# EAGLE schematic POCN_Vrevised_labeled_copied (EAGLE 9.6.2)
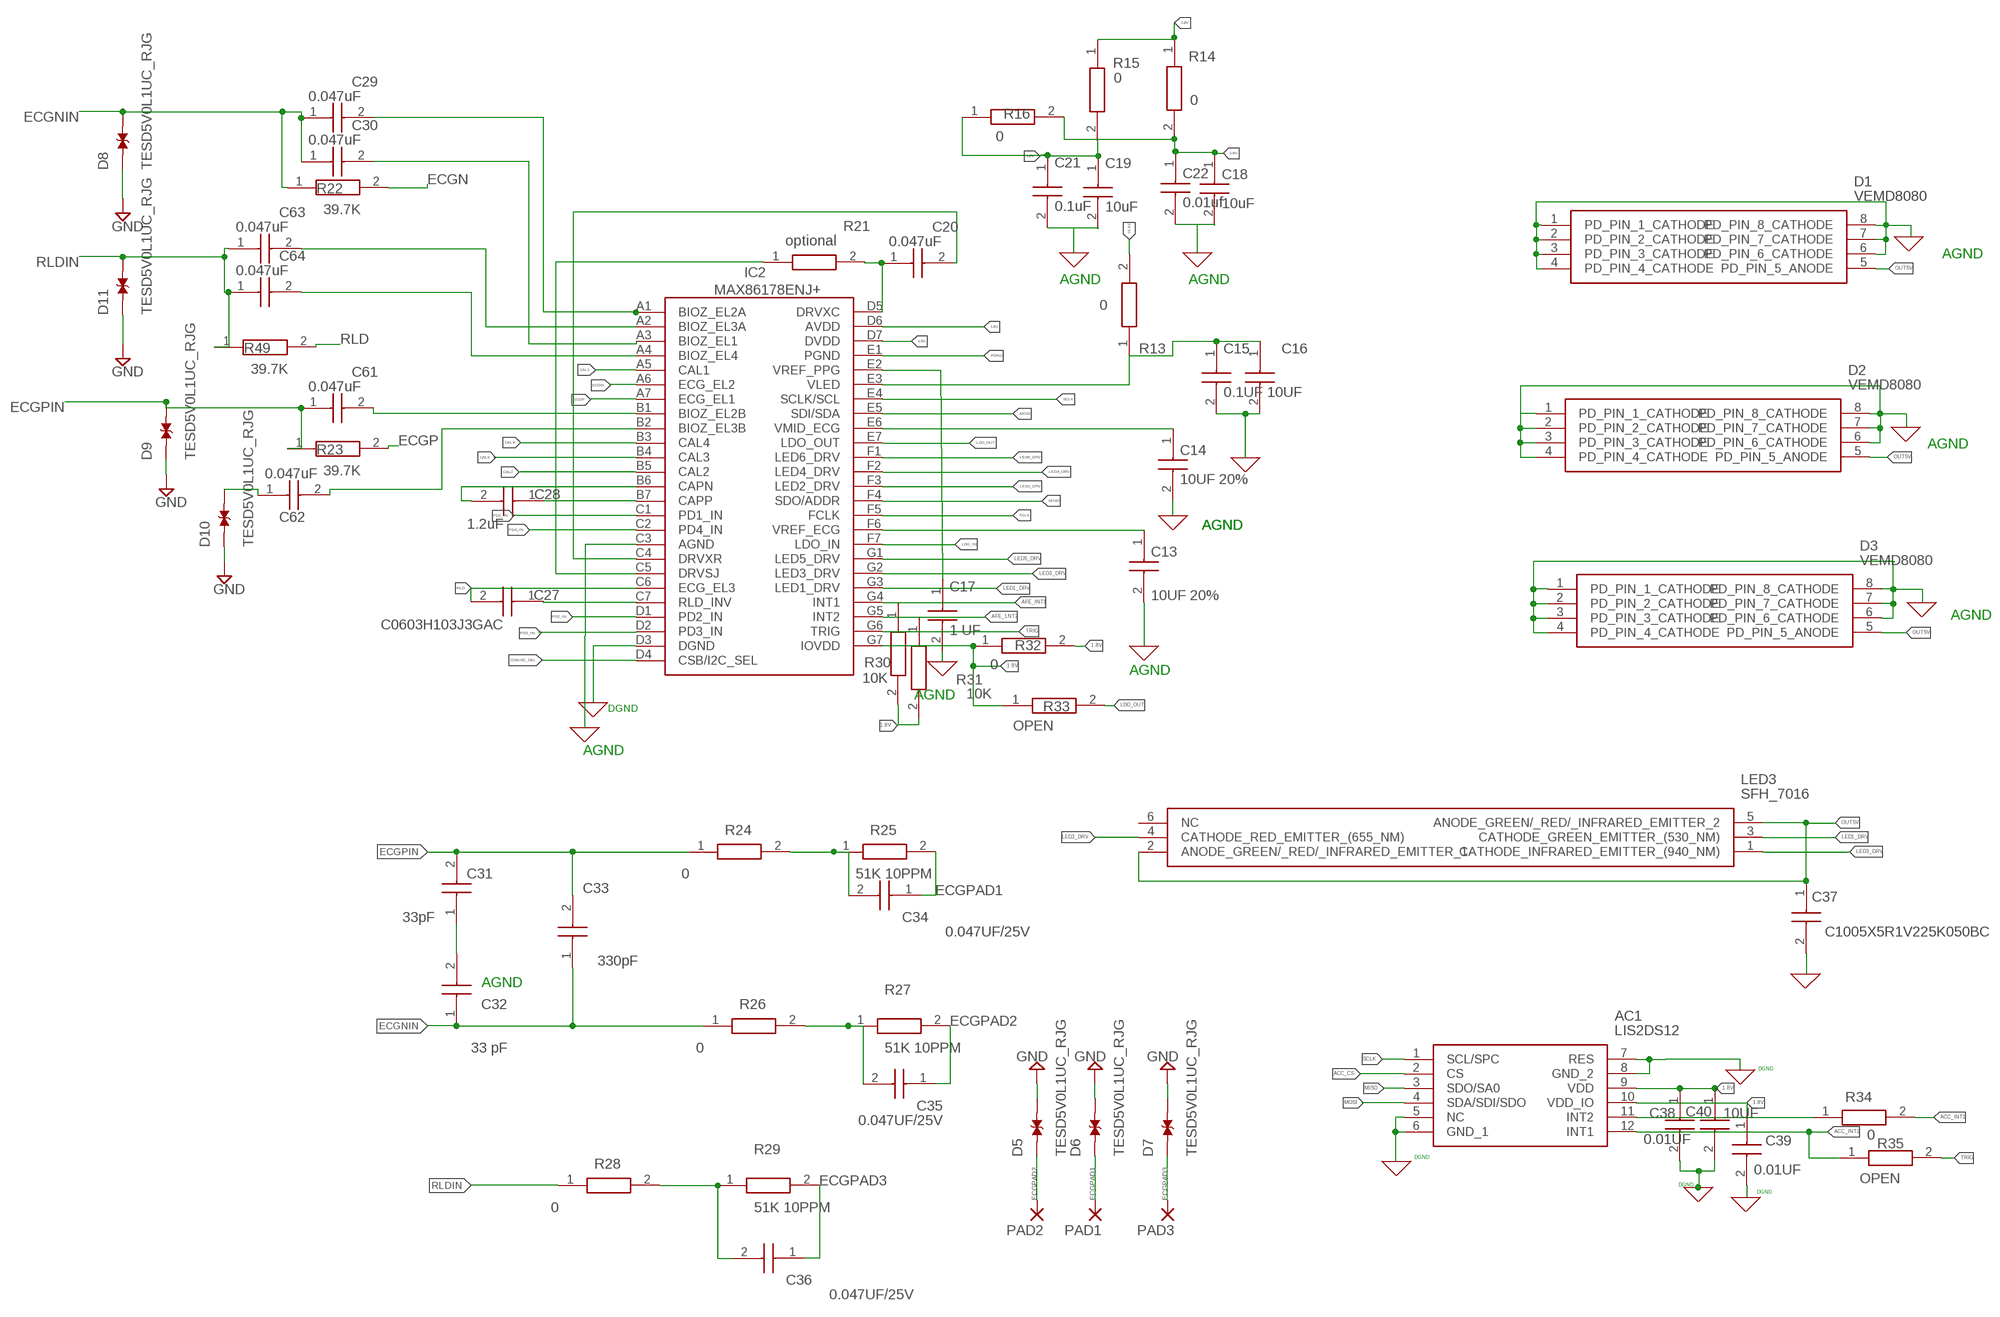
[diagram p0: schematic, sheet 1]

## Parts
AC1  LIS2DS12  [LGA-12]
C13  10UF 20%  GRM188R60J226ME15D  [CAPC1608X90N]
C14  10UF 20%  GRM188R60J226ME15D  [CAPC1608X90N]
C15  0.1UF  GRM188R60J226ME15D  [CAPC1608X90N]
C16  10UF  C1005X5R1V225K050BC  [C1005_COMMERCIAL]
C17  1 UF  C0603H103J3GAC  [C0603]
C18  10uF  C0603H103J3GAC  [C0603]
C19  10uF  C0603H103J3GAC  [C0603]
C20  0.047uF  C1005X5R1V225K050BC  [C1005_COMMERCIAL]
C21  0.1uF  C1005X5R1V225K050BC  [C1005_COMMERCIAL]
C22  0.01uf  C1005X5R1V225K050BC  [C1005_COMMERCIAL]
C27  C0603H103J3GAC  [C0603]
C28  1.2uF  C0603H103J3GAC  [C0603]
C29  0.047uF  C1005X5R1V225K050BC  [C1005_COMMERCIAL]
C30  0.047uF  C1005X5R1V225K050BC  [C1005_COMMERCIAL]
C31  33pF  C0603H103J3GAC  [C0603]
C32  33 pF  C0603H103J3GAC  [C0603]
C33  330pF  C0603H103J3GAC  [C0603]
C34  0.047UF/25V  C0603H103J3GAC  [C0603]
C35  0.047UF/25V  C0603H103J3GAC  [C0603]
C36  0.047UF/25V  C0603H103J3GAC  [C0603]
C37  C1005X5R1V225K050BC  [C1005_COMMERCIAL]
C38  0.01UF  C1005X5R1V225K050BC  [C1005_COMMERCIAL]
C39  0.01UF  C1005X5R1V225K050BC  [C1005_COMMERCIAL]
C40  10UF  C0805C125K4RACTU  [CAPC2012X88N]
C61  0.047uF  C1005X5R1V225K050BC  [C1005_COMMERCIAL]
C62  0.047uF  C1005X5R1V225K050BC  [C1005_COMMERCIAL]
C63  0.047uF  C1005X5R1V225K050BC  [C1005_COMMERCIAL]
C64  0.047uF  C1005X5R1V225K050BC  [C1005_COMMERCIAL]
D1  VEMD8080  [VEMD8080]
D2  VEMD8080  [VEMD8080]
D3  VEMD8080  [VEMD8080]
D5  TESD5V0L1UC_RJG  [DIO_TESD5V0L1UC_RJG]
D6  TESD5V0L1UC_RJG  [DIO_TESD5V0L1UC_RJG]
D7  TESD5V0L1UC_RJG  [DIO_TESD5V0L1UC_RJG]
D8  TESD5V0L1UC_RJG  [DIO_TESD5V0L1UC_RJG]
D9  TESD5V0L1UC_RJG  [DIO_TESD5V0L1UC_RJG]
D10  TESD5V0L1UC_RJG  [DIO_TESD5V0L1UC_RJG]
D11  TESD5V0L1UC_RJG  [DIO_TESD5V0L1UC_RJG]
IC2  MAX86178ENJ+  [BGA49C35P7X7_277X257X50]
LED3  SFH_7016  [SFH7016]
PAD1  SMD5  [SMD2,54-5,08]
PAD2  SMD5  [SMD2,54-5,08]
PAD3  SMD5  [SMD2,54-5,08]
R13  0  CRCW0402499RFKED  [RESC1005X40N]
R14  0  CRCW0402499RFKED  [RESC1005X40N]
R15  0  CRCW0402499RFKED  [RESC1005X40N]
R16  0  CRCW0402499RFKED  [RESC1005X40N]
R21  optional  CRCW0402499RFKED  [RESC1005X40N]
R22  39.7K  CRCW0402499RFKED  [RESC1005X40N]
R23  39.7K  CRCW0402499RFKED  [RESC1005X40N]
R24  0  CRCW060310K0FKEI  [RESC1608X50N]
R25  51K 10PPM  CRCW060310K0FKEI  [RESC1608X50N]
R26  0  CRCW060310K0FKEI  [RESC1608X50N]
R27  51K 10PPM  CRCW060310K0FKEI  [RESC1608X50N]
R28  0  CRCW060310K0FKEI  [RESC1608X50N]
R29  51K 10PPM  CRCW060310K0FKEI  [RESC1608X50N]
R30  10K  CRCW060310K0FKEI  [RESC1608X50N]
R31  10K  CRCW060310K0FKEI  [RESC1608X50N]
R32  0  CRCW060310K0FKEI  [RESC1608X50N]
R33  OPEN  CRCW060310K0FKEI  [RESC1608X50N]
R34  0  CRCW0402499RFKED  [RESC1005X40N]
R35  OPEN  CRCW0402499RFKED  [RESC1005X40N]
R49  39.7K  CRCW0402499RFKED  [RESC1005X40N]

## Nets
1.8V: AC1.9(VDD) AC1.10(VDD_IO) C18.1 C19.1 C21.1 C22.1 C38.1 C39.1 C40.1 IC2.D6(AVDD) IC2.D7(DVDD) R14.1 R14.2 R15.1 R15.2 R16.1 R16.2 R30.2 R31.2 R32.2
ACC_CS: AC1.2(CS)
ACC_INT1: R34.2
ACC_INT2: AC1.12(INT1) R35.1
AFE_1NT2: IC2.G5(INT2)
AFE_INT1: IC2.G4(INT1)
AGND: AC1.7(RES) AC1.8(GND_2) C13.2 C14.2 C15.2 C16.2 C17.2 ; supply symbol labelled GND
CAL1: IC2.A5(CAL1)
CAL2: IC2.B5(CAL2)
CAL3: IC2.B4(CAL3)
CAL4: IC2.B3(CAL4)
CSB/I2C_SEL: IC2.D4(CSB/I2C_SEL)
ECGN: IC2.A6(ECG_EL2) R22.2
ECGNIN: C29.1 C30.1 C32.1 C33.1 D8.2 R22.1 R26.1
ECGP: IC2.A7(ECG_EL1) R23.2
ECGPAD1: C34.1 D6.1 PAD1.1(P) R25.2
ECGPAD2: C35.1 D5.1 PAD2.1(P) R27.2
ECGPAD3: C36.1 D7.1 PAD3.1(P) R29.2
ECGPIN: C31.2 C33.2 C61.1 D9.2 R23.1 R24.1
FCLK: IC2.F5(FCLK)
GND: D5.2 D6.2 D7.2 D8.1 D9.1 D10.1 D11.1
LDO_IN: IC2.F7(LDO_IN)
LDO_OUT: IC2.E7(LDO_OUT) R33.2
LED1_DRV: IC2.G3(LED1_DRV) LED3.3(CATHODE_GREEN_EMITTER_(530_NM))
LED2_DRV: IC2.F3(LED2_DRV)
LED3_DRV: IC2.G2(LED3_DRV) LED3.1(CATHODE_INFRARED_EMITTER_(940_NM)) LED3.4(CATHODE_RED_EMITTER_(655_NM))
LED4_DRV: IC2.F2(LED4_DRV)
LED5_DRV: IC2.G1(LED5_DRV)
LED6_DRV: IC2.F1(LED6_DRV)
MISO: AC1.3(SDO/SA0) IC2.F4(SDO/ADDR)
MOSI: AC1.4(SDA/SDI/SDO) IC2.E5(SDI/SDA)
N$3: C37.2
N$5: D1.1(PD_PIN_1_CATHODE) D1.2(PD_PIN_2_CATHODE) D1.3(PD_PIN_3_CATHODE) D1.4(PD_PIN_4_CATHODE) D1.6(PD_PIN_6_CATHODE) D1.7(PD_PIN_7_CATHODE) D1.8(PD_PIN_8_CATHODE)
N$7: AC1.5(NC) AC1.6(GND_1)
N$26: C13.1 IC2.F6(VREF_ECG)
N$30: C14.1 IC2.E6(VMID_ECG)
N$31: IC2.E3(VLED)
N$32: C17.1 IC2.E2(VREF_PPG)
N$33: C15.1 C16.1 R13.1
N$46: C20.1 IC2.D5(DRVXC) R21.2
N$47: C19.2 C21.2
N$48: C18.2 C22.2
N$49: C20.2 IC2.C4(DRVXR)
N$50: IC2.C5(DRVSJ) R21.1
N$51: C27.1 IC2.C7(RLD_INV)
N$52: IC2.D3(DGND)
N$53: IC2.C3(AGND)
N$55: IC2.B7(CAPP)
N$56: C28.2 IC2.B6(CAPN)
N$57: C30.2 IC2.A3(BIOZ_EL1)
N$60: C61.2 IC2.B1(BIOZ_EL2B)
N$61: C62.1 D10.2
N$62: C62.2 IC2.B2(BIOZ_EL3B)
N$64: C63.2 IC2.A2(BIOZ_EL3A)
N$65: C64.2 IC2.A4(BIOZ_EL4)
N$67: C29.2 IC2.A1(BIOZ_EL2A)
N$68: D3.1(PD_PIN_1_CATHODE) D3.2(PD_PIN_2_CATHODE) D3.3(PD_PIN_3_CATHODE) D3.4(PD_PIN_4_CATHODE) D3.6(PD_PIN_6_CATHODE) D3.7(PD_PIN_7_CATHODE) D3.8(PD_PIN_8_CATHODE)
N$69: C35.2 R26.2 R27.1
N$70: C31.1 C32.2
N$71: D2.1(PD_PIN_1_CATHODE) D2.2(PD_PIN_2_CATHODE) D2.3(PD_PIN_3_CATHODE) D2.4(PD_PIN_4_CATHODE) D2.6(PD_PIN_6_CATHODE) D2.7(PD_PIN_7_CATHODE) D2.8(PD_PIN_8_CATHODE)
N$72: C34.2 R24.2 R25.1
N$76: C36.2 R28.2 R29.1
N$78: IC2.G7(IOVDD) R32.1 R33.1
N$82: AC1.11(INT2) R34.1
N$84: C38.2 C40.2
N$86: C39.2
OUT5V: C37.1 D1.5(PD_PIN_5_ANODE) D2.5(PD_PIN_5_ANODE) D3.5(PD_PIN_5_ANODE) LED3.2(ANODE_GREEN/_RED/_INFRARED_EMITTER_1) LED3.5(ANODE_GREEN/_RED/_INFRARED_EMITTER_2)
PD1_IN: IC2.C1(PD1_IN)
PD2_IN: IC2.D1(PD2_IN)
PD3_IN: IC2.D2(PD3_IN)
PD4_IN: IC2.C2(PD4_IN)
PGND: IC2.E1(PGND)
RLD: C27.2 IC2.C6(ECG_EL3) R49.2
RLDIN: C63.1 C64.1 D11.2 R28.1 R49.1
SCLK: AC1.1(SCL/SPC) IC2.E4(SCLK/SCL)
TRIG: IC2.G6(TRIG) R35.2
VLED: R13.2
Unconnected: C28.1 LED3.6(NC) R30.1 R31.1

## Notes on the sheet
- AGND
- AGND | AGND
- AGND
- AGND | AGND
- AGND
- AGND
- AGND
- DGND
- AGND
- AGND
- DGND
- DGND
- DGND
- DGND

## Library data of the parts
AC1 = LIS2DS12:LIS2DS12: STMicroelectronics LIS2DS12 3-Axis Accelerometer Ic, 1.62 1.98 V 12-Pin LGA Source: Datasheet <http://www.st.com/content/ccc/resource/technical/document/datasheet/ce/32/55/ac/e1/87/46/84/DM00177048.pdf/files/DM00177048.pdf/jcr:content/translations/en.DM00177048.pdf>; DESCRIPTION: STMicroelectronics LIS2DS12 3-Axis Accelerometer Ic, 1.62 1.98 V 12-Pin LGA; HEIGHT: mm; MANUFACTURER_NAME: STMicroelectronics; MANUFACTURER_PART_NUMBER: LIS2DS12
C13-C15 = GRM188R60J226ME15D:GRM188R60J226ME15D: Multilayer Ceramic Capacitors MLCC - SMD/SMT Source: Datasheet <http://componentsearchengine.com/Datasheets/1/GRM188R60J226ME15D.pdf>; ARROW_PART_NUMBER: GRM188R60J226ME15D; ARROW_PRICE-STOCK: https://www.arrow.com/en/products/grm188r60j226me15d/murata-manufacturing; DESCRIPTION: Multilayer Ceramic Capacitors MLCC - SMD/SMT; HEIGHT: 0.9mm; MANUFACTURER_NAME: Murata Electronics; MANUFACTURER_PART_NUMBER: GRM188R60J226ME15D; MOUSER_PART_NUMBER: 81-GRM188R60J226ME5D; MOUSER_PRICE-STOCK: https://www.mouser.co.uk/ProductDetail/Murata-Electronics/GRM188R60J226ME15D/?qs=84nSAGdh8NVUbroaMW6uAg%3D%3D
C16 C20-C22 C29 C30 C37-C39 C61-C64 = C1005X5R1V225K050BC:C1005X5R1V225K050BC: MULTILAYER CERAMIC CHIP CAPACITORS, 1005, Commercial grade, general (Up to 75V) Source: Datasheet <https://product.tdk.com/system/files/dam/doc/product/capacitor/ceramic/mlcc/catalog/mlcc_commercial_general_en.pdf>; ARROW_PART_NUMBER: C1005X5R1V225K050BC; ARROW_PRICE-STOCK: https://www.arrow.com/en/products/c1005x5r1v225k050bc/tdk; DESCRIPTION: MULTILAYER CERAMIC CHIP CAPACITORS, 1005, Commercial grade, general (Up to 75V); HEIGHT: 0.55mm; MANUFACTURER_NAME: TDK; MANUFACTURER_PART_NUMBER: C1005X5R1V225K050BC; MOUSER_PART_NUMBER: 810-C1005X5R1V225K; MOUSER_PRICE-STOCK: https://www.mouser.co.uk/ProductDetail/TDK/C1005X5R1V225K050BC?qs=dfay7wIA1uHOji3UDo6xhw%3D%3D
C17-C19 C27 C28 C31-C36 = C0603H103J3GAC:C0603H103J3GAC: Kemet 0603 C 10nF Ceramic Multilayer Capacitor, 25 V dc, +200C, C0G Dielectric, +/-5% Source: Datasheet <https://connect.kemet.com:7667/gateway/IntelliData-ComponentDocumentation/1.0/download/specsheet/C0603H103J3GAC{BULK}>; DESCRIPTION: Kemet 0603 C 10nF Ceramic Multilayer Capacitor, 25 V dc, +200C, C0G Dielectric, +/-5%; HEIGHT: 0.87mm; MANUFACTURER_NAME: Kemet; MANUFACTURER_PART_NUMBER: C0603H103J3GAC
C40 = C0805C125K4RACTU:C0805C125K4RACTU: Multilayer Ceramic Capacitors MLCC - SMD/SMT 16volts 1.2uF X7R 10% Source: Datasheet <https://componentsearchengine.com/Datasheets/1/C0805C125K4RACTU.pdf>; ARROW_PART_NUMBER: C0805C125K4RACTU; ARROW_PRICE-STOCK: https://www.arrow.com/en/products/c0805c125k4ractu/kemet-corporation; DESCRIPTION: Multilayer Ceramic Capacitors MLCC - SMD/SMT 16volts 1.2uF X7R 10%; HEIGHT: 0.88mm; MANUFACTURER_NAME: Kemet; MANUFACTURER_PART_NUMBER: C0805C125K4RACTU; MOUSER_PART_NUMBER: 80-C0805C125K4R; MOUSER_PRICE-STOCK: https://www.mouser.com/Search/Refine.aspx?Keyword=80-C0805C125K4R
D1-D3 = VEMD8080:VEMD8080: Photodiodes Pin Photodiode 20V 350-1100nm; 28uA Source: Datasheet <https://www.vishay.com/docs/84565/vemd8080.pdf>; ARROW_PART_NUMBER: VEMD8080; ARROW_PRICE-STOCK: https://www.arrow.com/en/products/vemd8080/vishay?region=nac; DESCRIPTION: Photodiodes Pin Photodiode 20V 350-1100nm; 28uA; HEIGHT: 0.53mm; MANUFACTURER_NAME: Vishay; MANUFACTURER_PART_NUMBER: VEMD8080; MOUSER_PART_NUMBER: 78-VEMD8080; MOUSER_PRICE-STOCK: https://www.mouser.co.uk/ProductDetail/Vishay-Semiconductors/VEMD8080?qs=F5EMLAvA7IBCchs2bw9l%2Fw%3D%3D
D5-D11 = TESD5V0L1UC_RJG:TESD5V0L1UC_RJG: Check availability <https://pricing.snapeda.com/parts/TESD5V0L1UC%20RJG/Taiwan%20Semiconductor%20Corporation/view-part?ref=eda>; AVAILABILITY: In Stock; DESCRIPTION: DFN1006L, 5V, 100W, 2pF, ESD Protection Diode & Array; MF: Taiwan Semiconductor Corporation; MP: TESD5V0L1UC RJG; PACKAGE: DFN1006L Taiwan Semiconductor; PRICE: None; PURCHASE-URL: https://pricing.snapeda.com/search/part/TESD5V0L1UC RJG/?ref=eda
IC2 = MAX86178ENJ+:MAX86178ENJ+: Ultra-Low-Power, Clinical-Grade Vital-Sign AFE Source: Datasheet <https://g.componentsearchengine.com/Datasheets/0/15123195.pdf>; DESCRIPTION: Ultra-Low-Power, Clinical-Grade Vital-Sign AFE; HEIGHT: 0.5mm; MANUFACTURER_NAME: Maxim Integrated; MANUFACTURER_PART_NUMBER: MAX86178ENJ+; MOUSER_PART_NUMBER: N/A; MOUSER_PRICE-STOCK: https://www.mouser.co.uk/ProductDetail/Maxim-Integrated/MAX86178ENJ%2b?qs=A6eO%252BMLsxmRF4ok651ufOA%3D%3D
LED3 = SFH_7016:SFH_7016: Infrared Emitters Green / Red / IR LED 530nm, 655nm, 940nm Source: Datasheet <https://www.mouser.co.uk/ProductDetail/OSRAM-Opto-Semiconductors/SFH-7016?qs=OTrKUuiFdkaz7DXJqRo6mw==>; DESCRIPTION: Infrared Emitters Green / Red / IR LED 530nm, 655nm, 940nm; HEIGHT: 0.7mm; MANUFACTURER_NAME: OSRAM; MANUFACTURER_PART_NUMBER: SFH 7016; MOUSER_PART_NUMBER: 720-SFH7016; MOUSER_PRICE-STOCK: https://www.mouser.co.uk/ProductDetail/OSRAM-Opto-Semiconductors/SFH-7016?qs=OTrKUuiFdkaz7DXJqRo6mw%3D%3D
PAD1-PAD3 = wirepad:SMD5: SMD PAD
R13-R16 R21-R23 R34 R35 R49 = CRCW0402499RFKED:CRCW0402499RFKED: Vishay CRCW Series Thick Film Surface Mount Resistor 0402 Case 499 +/-1% 0.063W +/-100ppm/C Source: Datasheet <http://www.vishay.com/docs/20035/dcrcwe3.pdf>; ARROW_PART_NUMBER: CRCW0402499RFKED; ARROW_PRICE-STOCK: https://www.arrow.com/en/products/crcw0402499rfked/vishay; DESCRIPTION: Vishay CRCW Series Thick Film Surface Mount Resistor 0402 Case 499 +/-1% 0.063W +/-100ppm/C; HEIGHT: 0.4mm; MANUFACTURER_NAME: Vishay; MANUFACTURER_PART_NUMBER: CRCW0402499RFKED; MOUSER_PART_NUMBER: 71-CRCW0402-499-E3; MOUSER_PRICE-STOCK: https://www.mouser.co.uk/ProductDetail/Vishay-Dale/CRCW0402499RFKED?qs=hAuyw6LW%252BLiHBhQKHQmDog%3D%3D
R24-R33 = CRCW060310K0FKEI:CRCW060310K0FKEI: Standard Thick Film Chip Resistors value 10K0 ohm. Source: Datasheet <http://www.vishay.com/docs/20035/dcrcwe3.pdf>; ARROW_PART_NUMBER: CRCW060310K0FKEI; ARROW_PRICE-STOCK: https://www.arrow.com/en/products/crcw060310k0fkei/vishay; DESCRIPTION: Standard Thick Film Chip Resistors value 10K0 ohm.; HEIGHT: 0.5mm; MANUFACTURER_NAME: Vishay; MANUFACTURER_PART_NUMBER: CRCW060310K0FKEI